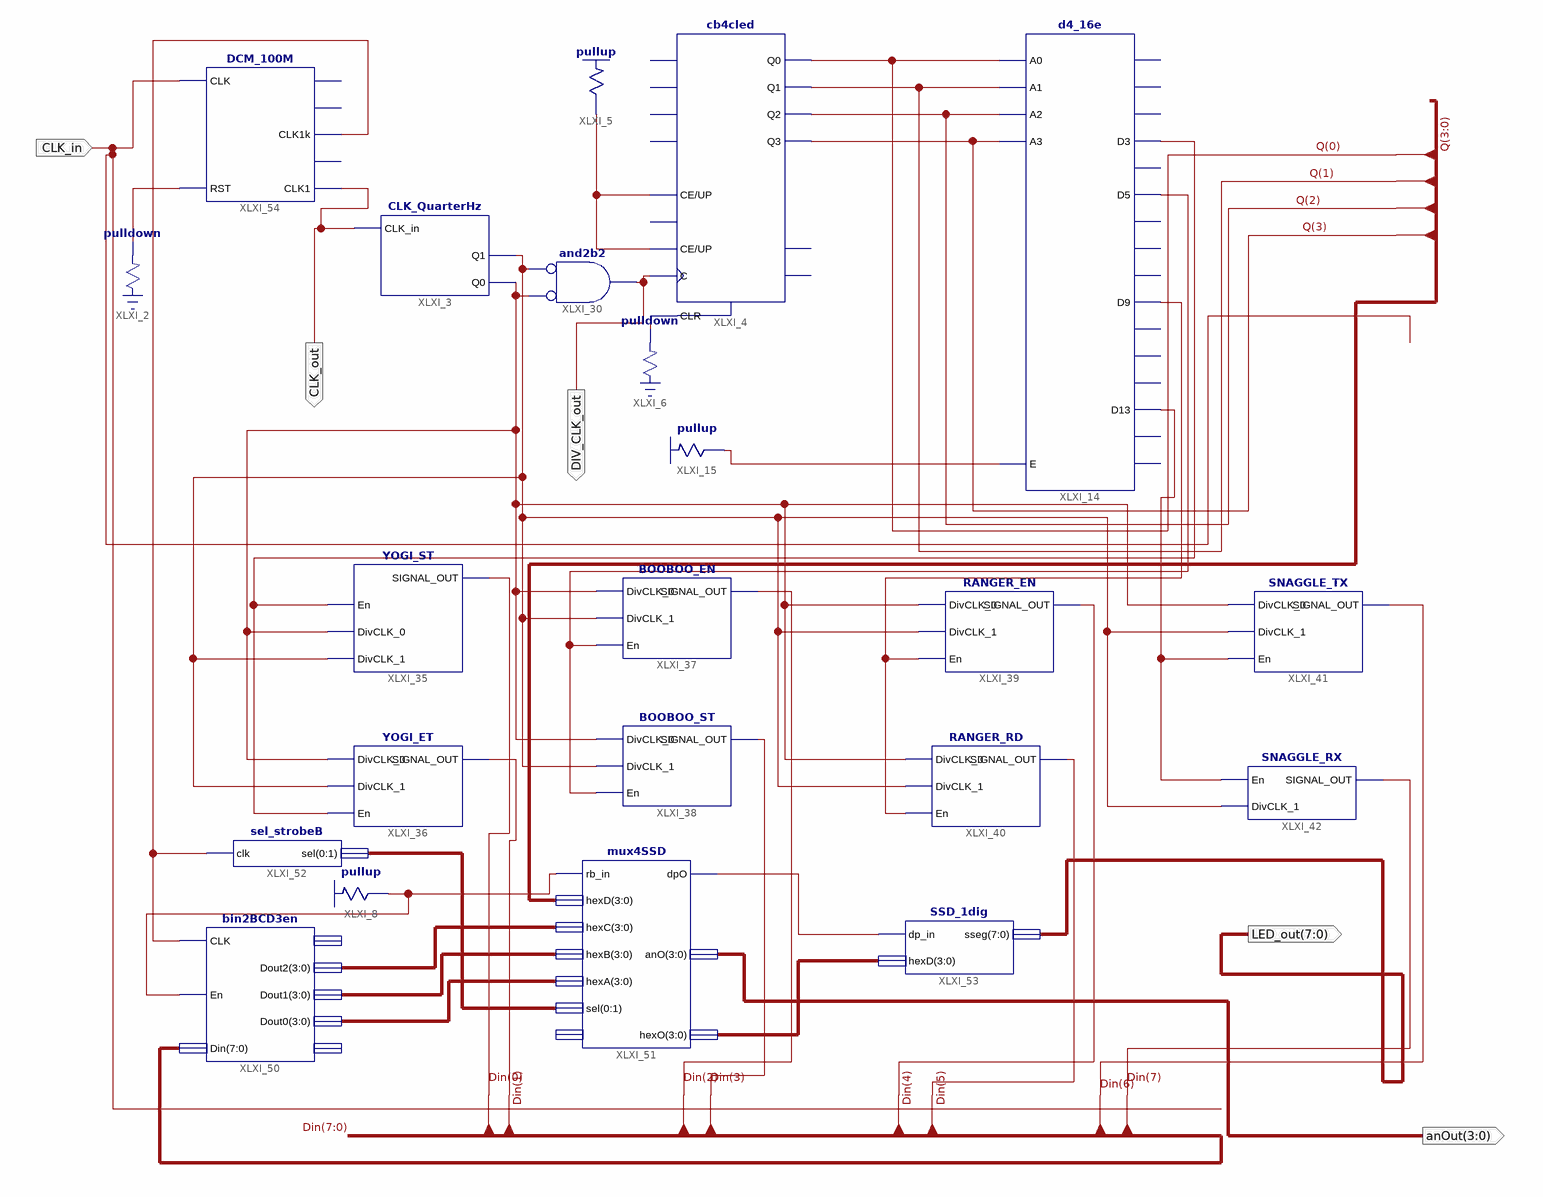
[diagram p0: schematic sheet 1]
// Xilinx ISE schematic sequence_generator.sch (spartan3e) as structural Verilog: 22 symbols, 5 ports
module sequence_generator (
  input  CLK_in,
  output [3:0] anOut,
  output DIV_CLK_out,
  output [7:0] LED_out,
  output CLK_out
);

  wire XLXN_5, XLXN_7, XLXN_28, XLXN_36, XLXN_54, XLXN_57, XLXN_74, XLXN_84, XLXN_94, XLXN_133, XLXN_139,
       XLXN_151, XLXN_153;
  wire [1:0] XLXN_134;
  wire [3:0] Q, XLXN_131, XLXN_140, XLXN_141, XLXN_142;
  wire [7:0] Din;

  \pulldown  XLXI_2 (.O(XLXN_151));
  CLK_QuarterHz XLXI_3 (.CLK_in(CLK_out), .Q1(XLXN_54), .Q0(XLXN_36));
  \pullup  XLXI_8 (.O(XLXN_139));
  cb4cled XLXI_4 (
    .C(DIV_CLK_out), .CE(XLXN_5), .CLR(XLXN_7), .UP(XLXN_5), .Q0(Q[0]), .Q1(Q[1]), .Q2(Q[2]), .Q3(Q[3]));  // open: D0, D1, D2, D3, L, CEO, TC
  \pullup  XLXI_5 (.O(XLXN_5));
  \pulldown  XLXI_6 (.O(XLXN_7));
  and XLXI_30 (DIV_CLK_out, ~XLXN_54, ~XLXN_36);  // and2b2
  d4_16e XLXI_14 (
    .A0(Q[0]), .A1(Q[1]), .A2(Q[2]), .A3(Q[3]), .E(XLXN_28), .D13(XLXN_94), .D3(XLXN_57), .D5(XLXN_74),
    .D9(XLXN_84));  // open: D0, D1, D10, D11, D12, D14, D15, D2, D4, D6, D7, D8
  \pullup  XLXI_15 (.O(XLXN_28));
  BOOBOO_EN XLXI_37 (.DivCLK_0(XLXN_36), .DivCLK_1(XLXN_54), .En(XLXN_74), .SIGNAL_OUT(Din[2]));
  BOOBOO_ST XLXI_38 (.DivCLK_0(XLXN_36), .DivCLK_1(XLXN_54), .En(XLXN_74), .SIGNAL_OUT(Din[3]));
  RANGER_EN XLXI_39 (.DivCLK_0(XLXN_36), .DivCLK_1(XLXN_54), .En(XLXN_84), .SIGNAL_OUT(Din[4]));
  RANGER_RD XLXI_40 (.DivCLK_0(XLXN_36), .DivCLK_1(XLXN_54), .En(XLXN_84), .SIGNAL_OUT(Din[5]));
  SNAGGLE_TX XLXI_41 (.DivCLK_0(XLXN_36), .DivCLK_1(XLXN_54), .En(XLXN_94), .SIGNAL_OUT(Din[6]));
  SNAGGLE_RX XLXI_42 (.En(XLXN_94), .DivCLK_1(XLXN_54), .SIGNAL_OUT(Din[7]));
  YOGI_ST XLXI_35 (.En(XLXN_57), .SIGNAL_OUT(Din[0]), .DivCLK_0(XLXN_36), .DivCLK_1(XLXN_54));
  YOGI_ET XLXI_36 (.DivCLK_0(XLXN_36), .DivCLK_1(XLXN_54), .En(XLXN_57), .SIGNAL_OUT(Din[1]));
  bin2BCD3en XLXI_50 (
    .CLK(XLXN_153), .En(XLXN_139), .Din(Din), .Dout2(XLXN_142), .Dout1(XLXN_141), .Dout0(XLXN_140));  // open: Dout3, RBout
  mux4SSD XLXI_51 (
    .rb_in(XLXN_139), .hexD(Q), .hexC(XLXN_142), .hexB(XLXN_141), .hexA(XLXN_140),
    .sel({XLXN_134[0], XLXN_134[1]}), .dpO(XLXN_133), .anO(anOut), .hexO(XLXN_131));  // open: dp_in
  sel_strobeB XLXI_52 (.clk(XLXN_153), .sel({XLXN_134[0], XLXN_134[1]}));
  SSD_1dig XLXI_53 (.dp_in(XLXN_133), .hexD(XLXN_131), .sseg(LED_out));
  DCM_100M XLXI_54 (.CLK(CLK_in), .RST(XLXN_151), .CLK1k(XLXN_153), .CLK1(CLK_out));  // open: CLK1M, CLK10k, CLK100
endmodule
